# EAGLE schematic GrovePi 1.0 (EAGLE 6.3)
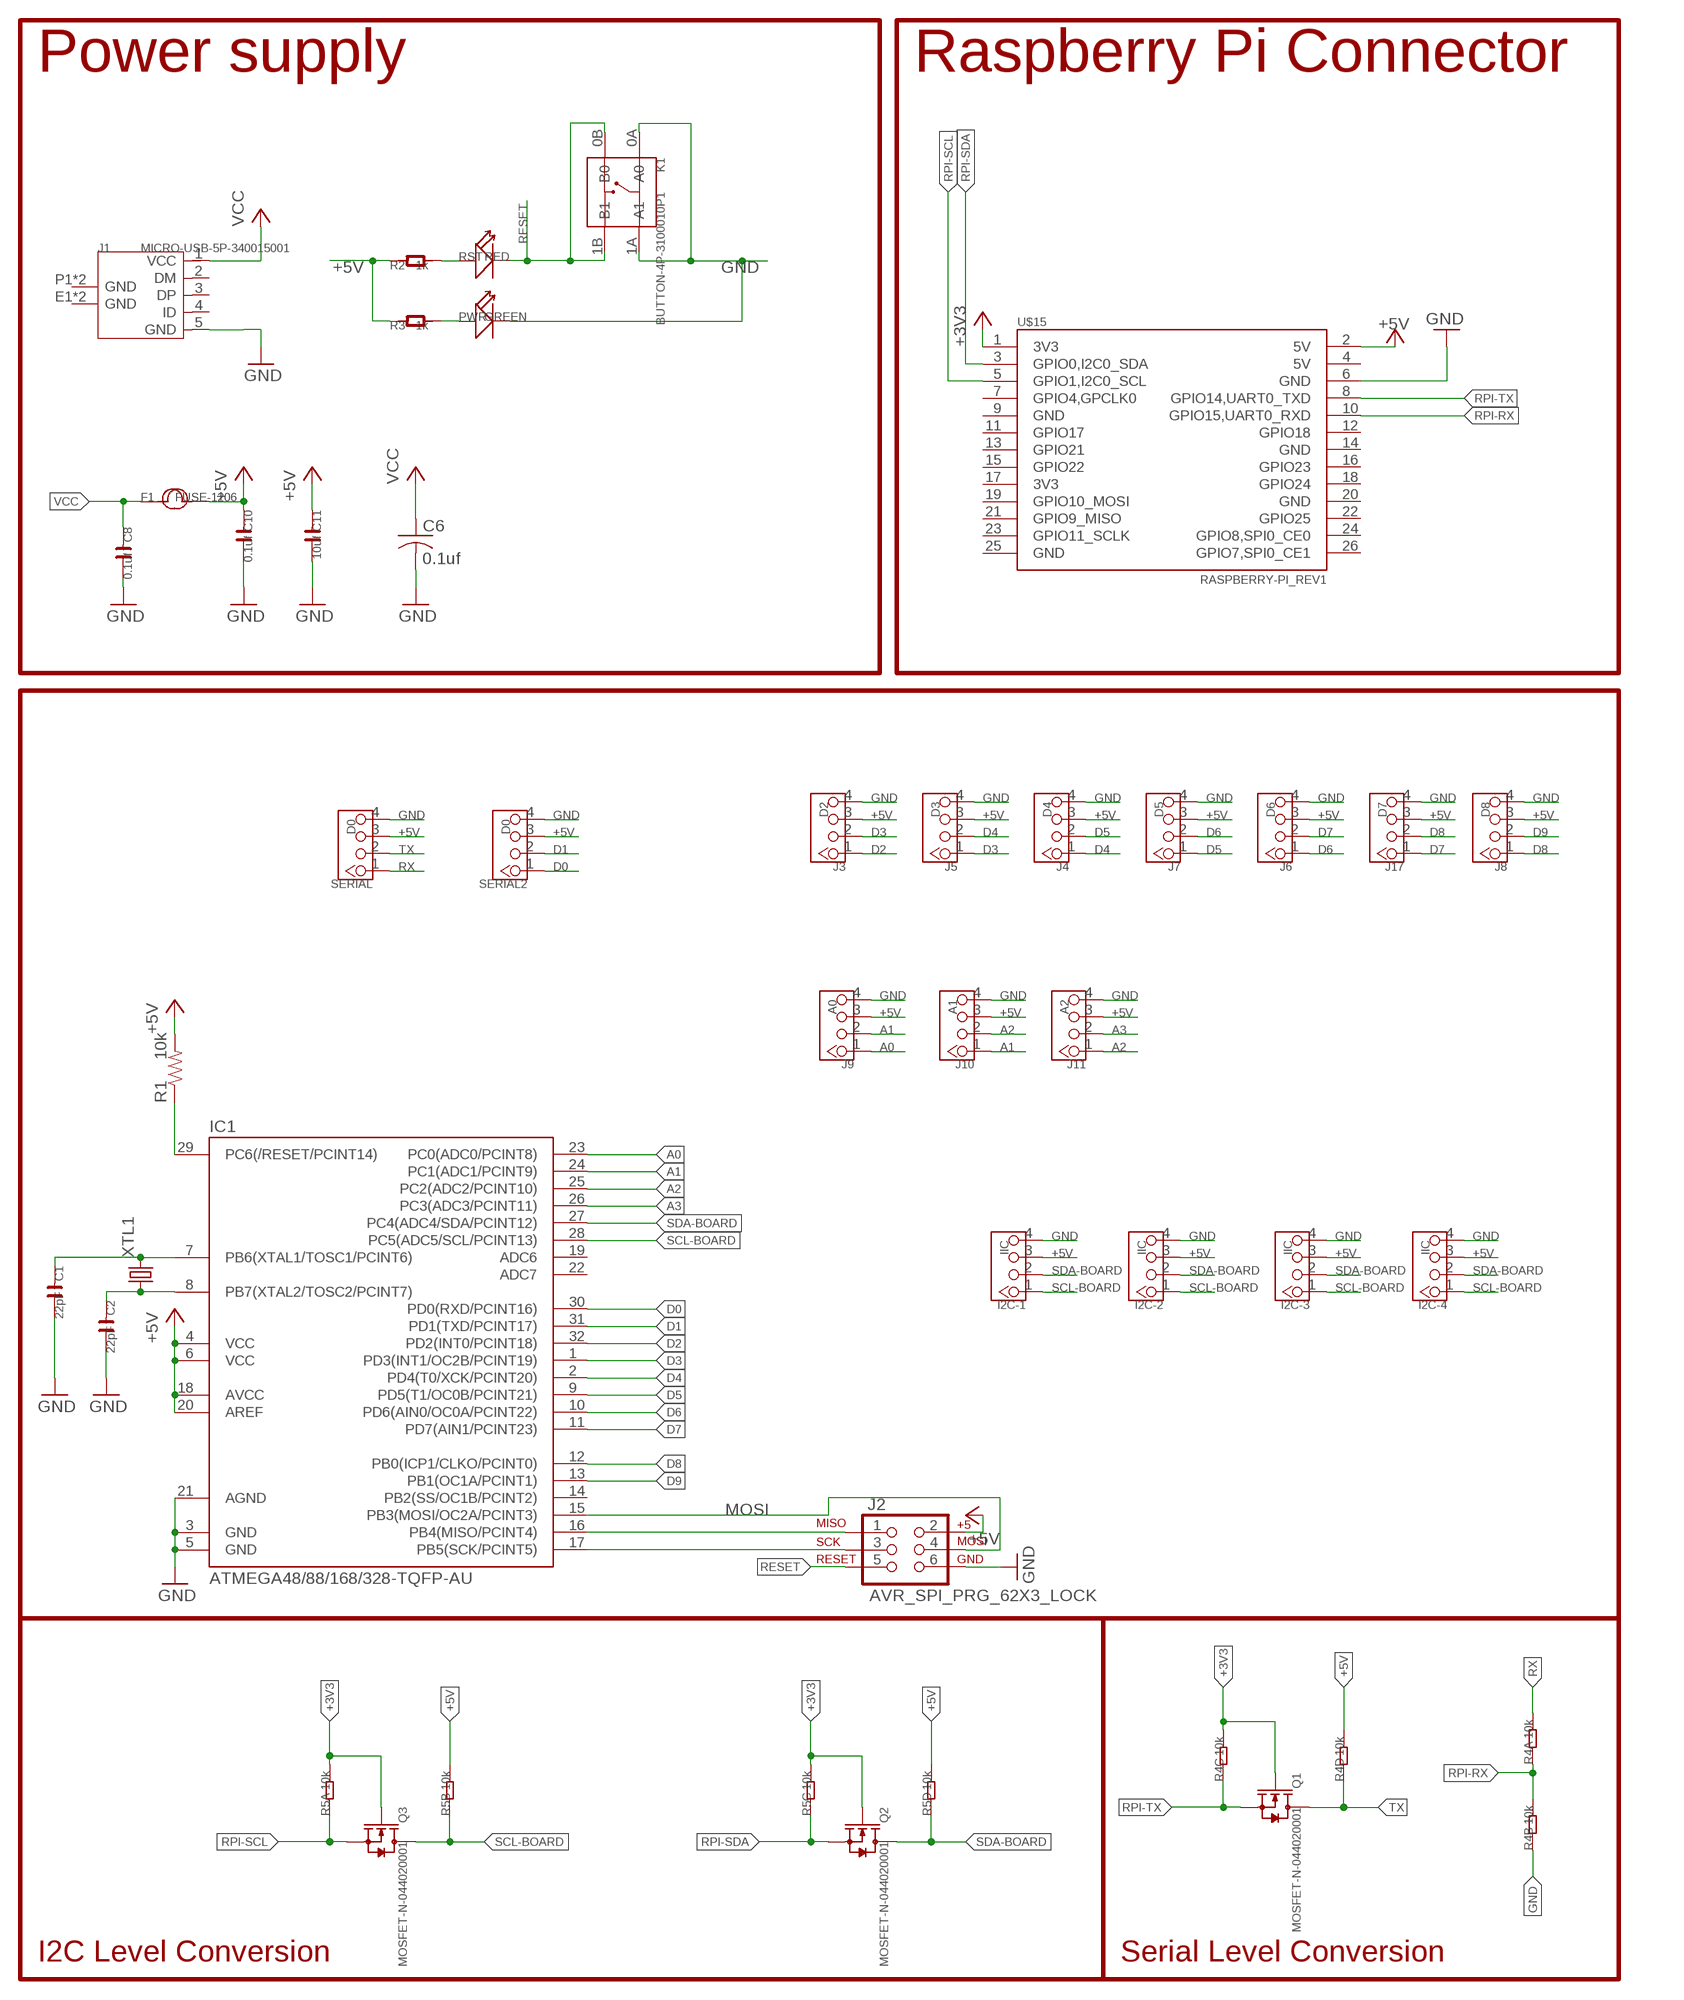
[diagram p0: schematic, sheet 1]

## Parts
C1  22pF  C-0805  [C0805]
C2  22pF  C-0805  [C0805]
C6  0.1uf  C-USC0805  [C0805@1]
C8  0.1uf  C-0805  [C0805]
C10  0.1uf  C-0805  [C0805]
C11  10uf  C-0805  [C0805]
F1  FUSE-1206  [F1206]
I2C-1  IIC  TWIG-4P-2.0'90D'  [4P-2.0-90D]
I2C-2  IIC  TWIG-4P-2.0'90D'  [4P-2.0-90D]
I2C-3  IIC  TWIG-4P-2.0'90D'  [4P-2.0-90D]
I2C-4  IIC  TWIG-4P-2.0'90D'  [4P-2.0-90D]
IC1  ATMEGA48/88/168/328-TQFP-AU  [TQFP32-08]
J1  MICRO-USB-5P-340015001  [B-SMD-5P]
J2  AVR_SPI_PRG_62X3_LOCK  [2X3_LOCK]
J3  D2  TWIG-4P-2.0'90D'  [4P-2.0-90D]
J4  D4  TWIG-4P-2.0'90D'  [4P-2.0-90D]
J5  D3  TWIG-4P-2.0'90D'  [4P-2.0-90D]
J6  D6  TWIG-4P-2.0'90D'  [4P-2.0-90D]
J7  D5  TWIG-4P-2.0'90D'  [4P-2.0-90D]
J8  D8  TWIG-4P-2.0'90D'  [4P-2.0-90D]
J9  A0  TWIG-4P-2.0'90D'  [4P-2.0-90D]
J10  A1  TWIG-4P-2.0'90D'  [4P-2.0-90D]
J11  A2  TWIG-4P-2.0'90D'  [4P-2.0-90D]
J17  D7  TWIG-4P-2.0'90D'  [4P-2.0-90D]
K1  BUTTON-4P-3100010P1  [4P-SMD-6.0X6.0X5.0H]
PWR  GREEN  LED  [LED0603]
Q1  MOSFET-N-044020001  [SOT23]
Q2  MOSFET-N-044020001  [SOT23]
Q3  MOSFET-N-044020001  [SOT23]
R1  10k  RESISTOR0603-RES  [0603]
R2  1k  R-0603  [R0603]
R3  1k  R-0603  [R0603]
R4  10k  R-4R  [R1206-8]
R5  10k  R-4R  [R1206-8]
RST  RED  LED  [LED0603]
SERIAL  D0  TWIG-4P-2.0'90D'  [4P-2.0-90D]
SERIAL2  D0  TWIG-4P-2.0'90D'  [4P-2.0-90D]
U$15  RASPBERRY-PI_REV1  [RASPBERRY-PI_REV1]
XTL1  CRYSTALHC49S  [HC49/S]

## Nets
+3V3: Q1.1(G) Q2.1(G) Q3.1(G) R4.6 R5.6 R5.8 U$15.1(3V3)
+5V: C6.1 C10.1 C11.1 F1.2 I2C-1.3 I2C-2.3 I2C-3.3 I2C-4.3 IC1.4(VCC) IC1.6(VCC) IC1.18(AVCC) IC1.20(AREF) J2.2 J3.3 J4.3 J5.3 J6.3 J7.3 J8.3 J9.3 J10.3 J11.3 J17.3 R1.2 R2.1 R3.1 R4.5 R5.5 R5.7 SERIAL2.3 SERIAL.3 U$15.2(5V) ; supply symbol labelled VCC
A0: IC1.23(PC0(ADC0/PCINT8)) J9.1
A1: IC1.24(PC1(ADC1/PCINT9)) J9.2 J10.1
A2: IC1.25(PC2(ADC2/PCINT10)) J10.2 J11.1
A3: IC1.26(PC3(ADC3/PCINT11)) J11.2
D0: IC1.30(PD0(RXD/PCINT16)) SERIAL2.1
D1: IC1.31(PD1(TXD/PCINT17)) SERIAL2.2
D2: IC1.32(PD2(INT0/PCINT18)) J3.1
D3: IC1.1(PD3(INT1/OC2B/PCINT19)) J3.2 J5.1
D4: IC1.2(PD4(T0/XCK/PCINT20)) J4.1 J5.2
D5: IC1.9(PD5(T1/OC0B/PCINT21)) J4.2 J7.1
D6: IC1.10(PD6(AIN0/OC0A/PCINT22)) J6.1 J7.2
D7: IC1.11(PD7(AIN1/PCINT23)) J6.2 J17.1
D8: IC1.12(PB0(ICP1/CLKO/PCINT0)) J8.1 J17.2
D9: IC1.13(PB1(OC1A/PCINT1)) J8.2
GND: C1.2 C2.2 C6.2 C8.2 C10.2 C11.2 I2C-1.4 I2C-2.4 I2C-3.4 I2C-4.4 IC1.3(GND) IC1.5(GND) IC1.21(AGND) J1.5(GND) J2.6 J3.4 J4.4 J5.4 J6.4 J7.4 J8.4 J9.4 J10.4 J11.4 J17.4 K1.0A(A0) K1.1A(A1) PWR.- R4.2 SERIAL2.4 SERIAL.4 U$15.6(GND)
MISO: IC1.16(PB4(MISO/PCINT4)) J2.1
MOSI: IC1.15(PB3(MOSI/OC2A/PCINT3)) J2.4
N$2: PWR.+ R3.2
N$5: C1.1 IC1.7(PB6(XTAL1/TOSC1/PCINT6)) XTL1.2
N$7: C2.1 IC1.8(PB7(XTAL2/TOSC2/PCINT7)) XTL1.1
N$17: R2.2 RST.+
RESET: IC1.29(PC6(/RESET/PCINT14)) J2.5 K1.0B(B0) K1.1B(B1) R1.1 RST.-
RPI-RX: R4.1 R4.7 U$15.10(GPIO15,UART0_RXD)
RPI-SCL: Q3.2(S) R5.1 U$15.5(GPIO1,I2C0_SCL)
RPI-SDA: Q2.2(S) R5.3 U$15.3(GPIO0,I2C0_SDA)
RPI-TX: Q1.2(S) R4.3 U$15.8(GPIO14,UART0_TXD)
RX: R4.8 SERIAL.1
SCK: IC1.17(PB5(SCK/PCINT5)) J2.3
SCL-BOARD: I2C-1.1 I2C-2.1 I2C-3.1 I2C-4.1 IC1.28(PC5(ADC5/SCL/PCINT13)) Q3.3(D) R5.2
SDA-BOARD: I2C-1.2 I2C-2.2 I2C-3.2 I2C-4.2 IC1.27(PC4(ADC4/SDA/PCINT12)) Q2.3(D) R5.4
TX: Q1.3(D) R4.4 SERIAL.2
VCC: C8.1 F1.1 J1.1(VCC)
Unconnected: IC1.14(PB2(SS/OC1B/PCINT2)) IC1.19(ADC6) IC1.22(ADC7) J1.2(DM) J1.3(DP) J1.4(ID) J1.E1(GND) J1.E2(GND) J1.P1(GND) J1.P2(GND) U$15.4(5V) U$15.7(GPIO4,GPCLK0) U$15.9(GND) U$15.11(GPIO17) U$15.12(GPIO18) U$15.13(GPIO21) U$15.14(GND) U$15.15(GPIO22) U$15.16(GPIO23) U$15.17(3V3) U$15.18(GPIO24) U$15.19(GPIO10_MOSI) U$15.20(GND) U$15.21(GPIO9_MISO) U$15.22(GPIO25) U$15.23(GPIO11_SCLK) U$15.24(GPIO8,SPI0_CE0) U$15.25(GND) U$15.26(GPIO7,SPI0_CE1)

## Notes on the sheet
- Power supply | Raspberry Pi Connector
- I2C Level Conversion | Serial Level Conversion

## Library data of the parts
C1 C2 C8 C10 C11 = OPL:C*
C6 = rcl:C-US: CAPACITOR, American symbol
F1 = OPL:FUSE*
I2C-1-I2C-4 J3-J11 J17 SERIAL SERIAL2 = Connector:TWIG-4P-2.0
IC1 = zz My Parts:ATMEGA48/88/168/328-TQFP
J1 = OPL:MICRO-USB-5P: ST-USB-001E：MICRO USB B SMD R/A
J2 = zz My Parts:AVR_SPI_PRG_6: AVR ISP 6 Pin This is the reduced ISP connector for AVR programming. Common on Arduino. This footprint will take up less PCB space and can be used with a 10-pin to 6-pin adapter such as SKU: BOB-08508
K1 = OPL:BUTTON-4P
PWR RST = OPL:LED*: LED
Q1-Q3 = OPL:MOSFET-N: CJ2302：SMD MOSFET N-CH 20V-2.1A
R1 = zz My Parts:RESISTOR: Resistor Basic schematic elements and footprints for resistors. 0603 and 0805 are mine.
R2 R3 = OPL:R*
R4 R5 = OPL:R-4R*: Resistor Array
U$15 = RaspberryPi:RASPBERRY-PI_REV1: Raspberry Pi Board <http://www.raspberrypi.org/> Jacques Lagnel V1.0 (beta) 2012 Mateusz Bawaj V1.1 (beta) 2012 Board dimension: Forum 3D model <http://www.raspberrypi.org/forum/general-discussion/mechanical-profile-3d-models?value=3d%20model&type=1&include=1&search=1&ret=all> The GPIO Connector (P1): http://elinux.org/RPi_Low-level_peripherals
XTL1 = crystal:CRYSTAL: CRYSTAL; OC_FARNELL: 1667008; OC_NEWARK: unknown